# EAGLE design Mithun_CEM (EAGLE 8.3.1)
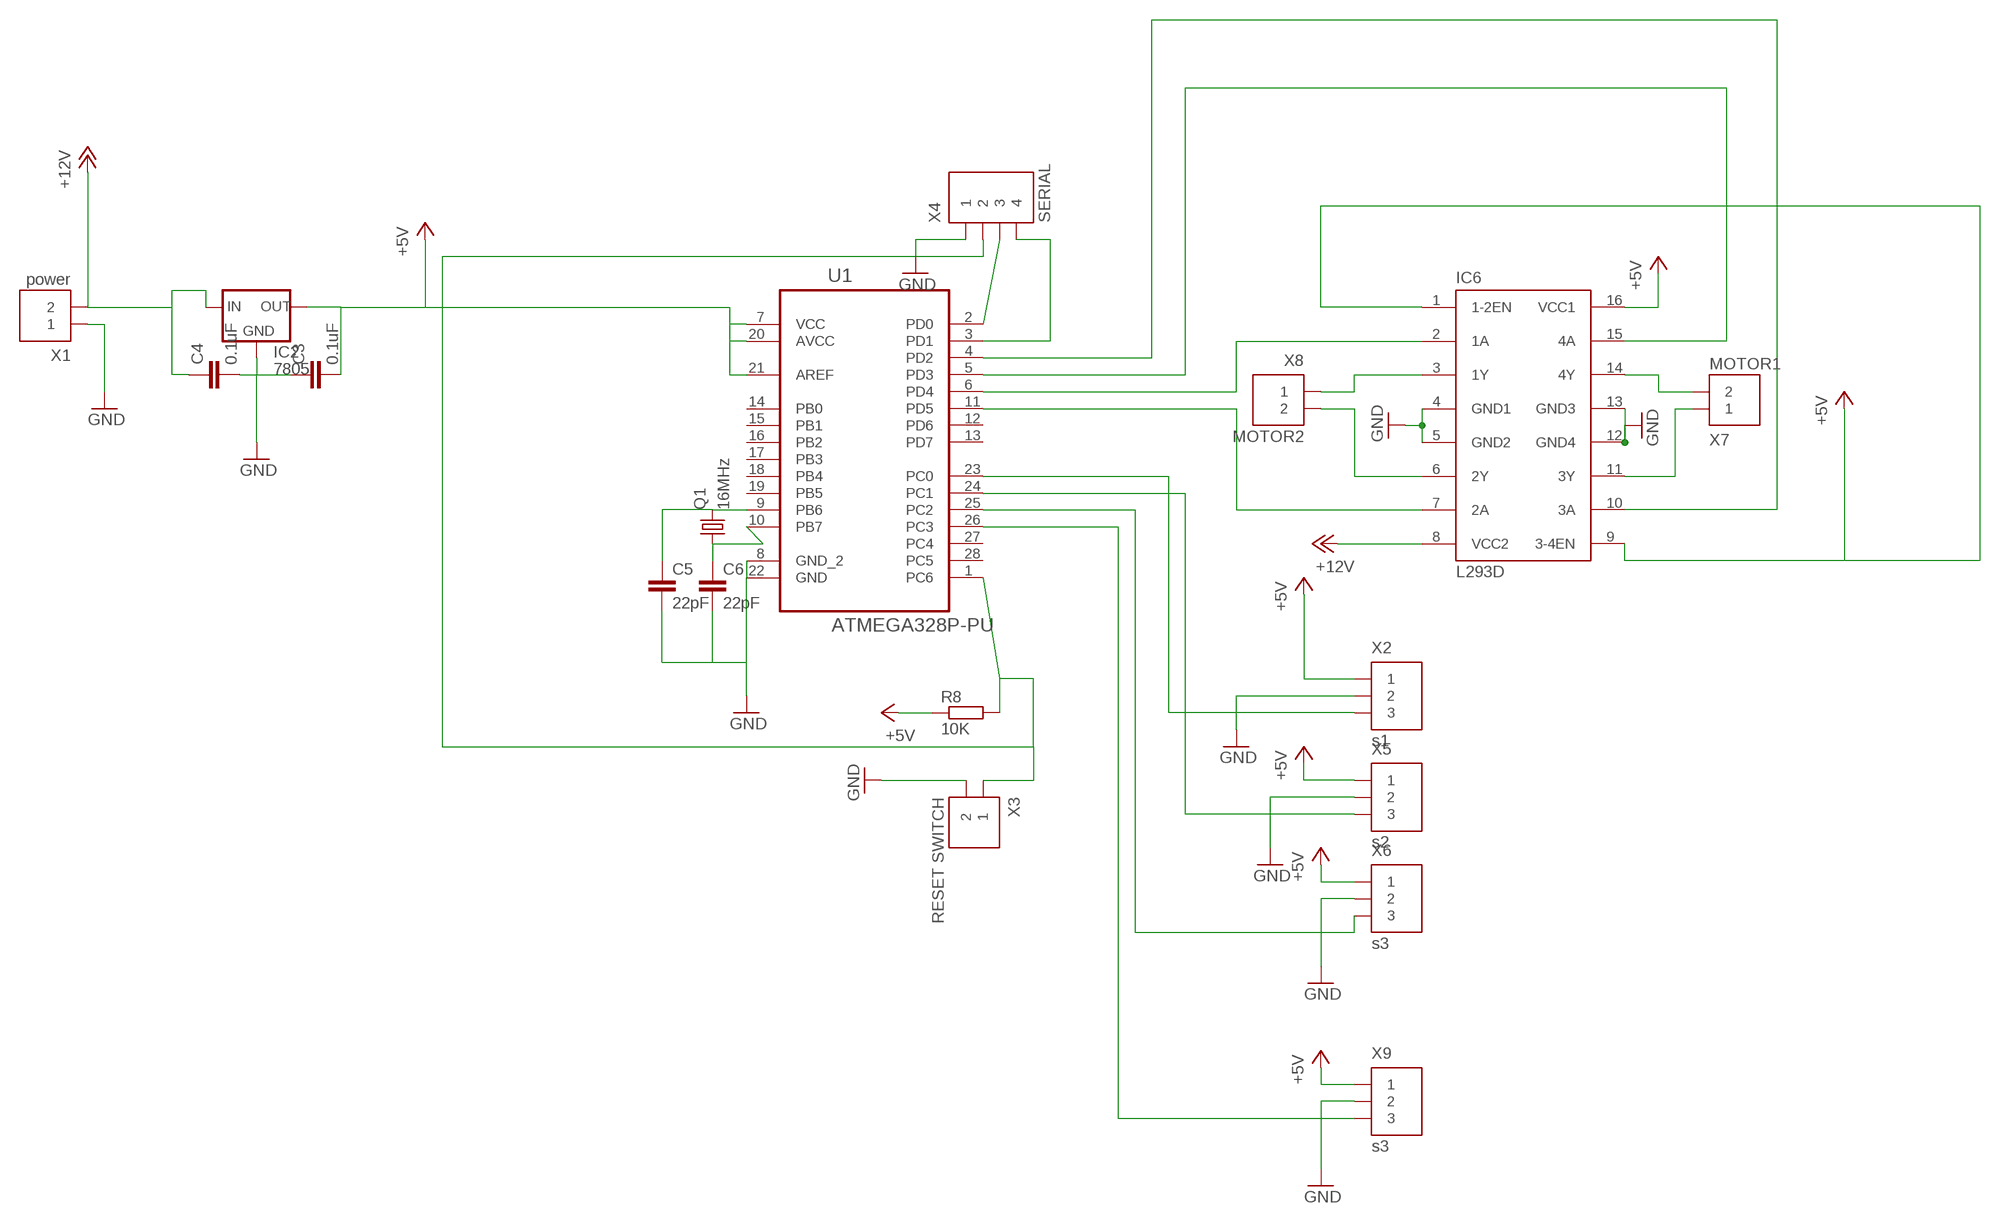
[diagram p0: schematic, sheet 1]

## Parts
C3  0.1uF  C-EU050-024X044  [C050-024X044]
C4  0.1uF  C-EU050-024X044  [C050-024X044]
C5  22pF  C-EU050-024X044  [C050-024X044]
C6  22pF  C-EU050-024X044  [C050-024X044]
IC2  7805  78MXXS  [78MXXS]
IC6  L293D  [DIL16]
Q1  16MHz  CRYSTALHC18U-V  [HC18U-V]
R8  10K  R-EU_0204/5  [0204/5]
U1  ATMEGA328P-PU  [DIP254P762X457-28]
X1  power  MKS1852-6-0-202  [MKS1852-6-0-202]
X2  s1  MKS1853-6-0-303  [MKS1853-6-0-303]
X3  RESET SWITCH  MKS1852-6-0-202  [MKS1852-6-0-202]
X4  SERIAL  MKS1854-6-0-404  [MKS1854-6-0-404]
X5  s2  MKS1853-6-0-303  [MKS1853-6-0-303]
X6  s3  MKS1853-6-0-303  [MKS1853-6-0-303]
X7  MOTOR1  MKS1852-6-0-202  [MKS1852-6-0-202]
X8  MOTOR2  MKS1852-6-0-202  [MKS1852-6-0-202]
X9  s3  MKS1853-6-0-303  [MKS1853-6-0-303]

## Nets
+5V: C3.2 IC2.OUT IC6.1(1-2EN) IC6.9(3-4EN) IC6.16(VCC1) R8.1 U1.7(VCC) U1.20(AVCC) U1.21(AREF) X2.1 X5.1 X6.1 X9.1
+12V: C4.1 IC2.IN IC6.8(VCC2) X1.2
GND: C3.1 C4.2 C5.2 C6.2 IC2.GND IC6.4(GND1) IC6.5(GND2) IC6.12(GND4) IC6.13(GND3) U1.8(GND_2) U1.22(GND) X1.1 X2.2 X3.2 X4.1 X5.2 X6.2 X9.2
N$1: IC6.15(4A) U1.5(PD3)
N$2: U1.23(PC0) X2.3
N$3: U1.26(PC3) X9.3
N$4: U1.24(PC1) X5.3
N$5: U1.25(PC2) X6.3
N$14: C5.1 Q1.2 U1.9(PB6)
N$15: C6.1 Q1.1 U1.10(PB7)
N$16: IC6.2(1A) U1.6(PD4)
N$23: R8.2 U1.1(PC6) X3.1 X4.2
N$24: U1.2(PD0) X4.3
N$30: U1.3(PD1) X4.4
N$49: IC6.10(3A) U1.4(PD2)
N$50: IC6.3(1Y) X8.1
N$51: IC6.6(2Y) X8.2
N$52: IC6.11(3Y) X7.1
N$53: IC6.14(4Y) X7.2
N$69: IC6.7(2A) U1.11(PD5)
Unconnected: U1.12(PD6) U1.13(PD7) U1.14(PB0) U1.15(PB1) U1.16(PB2) U1.17(PB3) U1.18(PB4) U1.19(PB5) U1.27(PC4) U1.28(PC5)

## Library data of the parts
C3-C6 = rcl:C-EU: CAPACITOR, European symbol
IC2 = v-reg:78MXXS: VOLTAGE REGULATOR
IC6 = st-microelectronics:L293D: PUSH-PULL 4 CHANNEL DRIVER; MPN: L293D; OC_FARNELL: 9589619; OC_NEWARK: 56P8249
Q1 = crystal:CRYSTAL: CRYSTAL; OC_FARNELL: unknown; OC_NEWARK: unknown
R8 = resistor:R-EU_: RESISTOR, European symbol
U1 = Atmel_By_element14_Batch_1-00:ATMEGA328P-PU: 8-bit Microcontroller with In-System Programmable Flash; MPN: ATMEGA328P-PU; OC_FARNELL: 1715487; OC_NEWARK: 15R0268; PACKAGE: PDIP-28; SUPPLIER: Atmel
X1 X3 X7 X8 = con-stocko:MKS1852-6-0-202: Serie MKS 1850 Lötstifte In-line, Raster 2.5 mm, Stiftwannen, stehend, mit Rastlasche Source: http://www.stocko.de/de/index.php?seite=ka_rfk2_mks1850.html&rubrik=Katalog+-+RFK+2 rfk_1850.pdf; OC_FARNELL: unknown; OC_NEWARK: unknown
X2 X5 X6 X9 = con-stocko:MKS1853-6-0-303: Serie MKS 1850 Lötstifte In-line, Raster 2.5 mm, Stiftwannen, stehend, mit Rastlasche Source: http://www.stocko.de/de/index.php?seite=ka_rfk2_mks1850.html&rubrik=Katalog+-+RFK+2 rfk_1850.pdf; OC_FARNELL: 1141861; OC_NEWARK: unknown
X4 = con-stocko:MKS1854-6-0-404: Serie MKS 1850 Lötstifte In-line, Raster 2.5 mm, Stiftwannen, stehend, mit Rastlasche Source: http://www.stocko.de/de/index.php?seite=ka_rfk2_mks1850.html&rubrik=Katalog+-+RFK+2 rfk_1850.pdf; OC_FARNELL: 1141862; OC_NEWARK: unknown

## Board
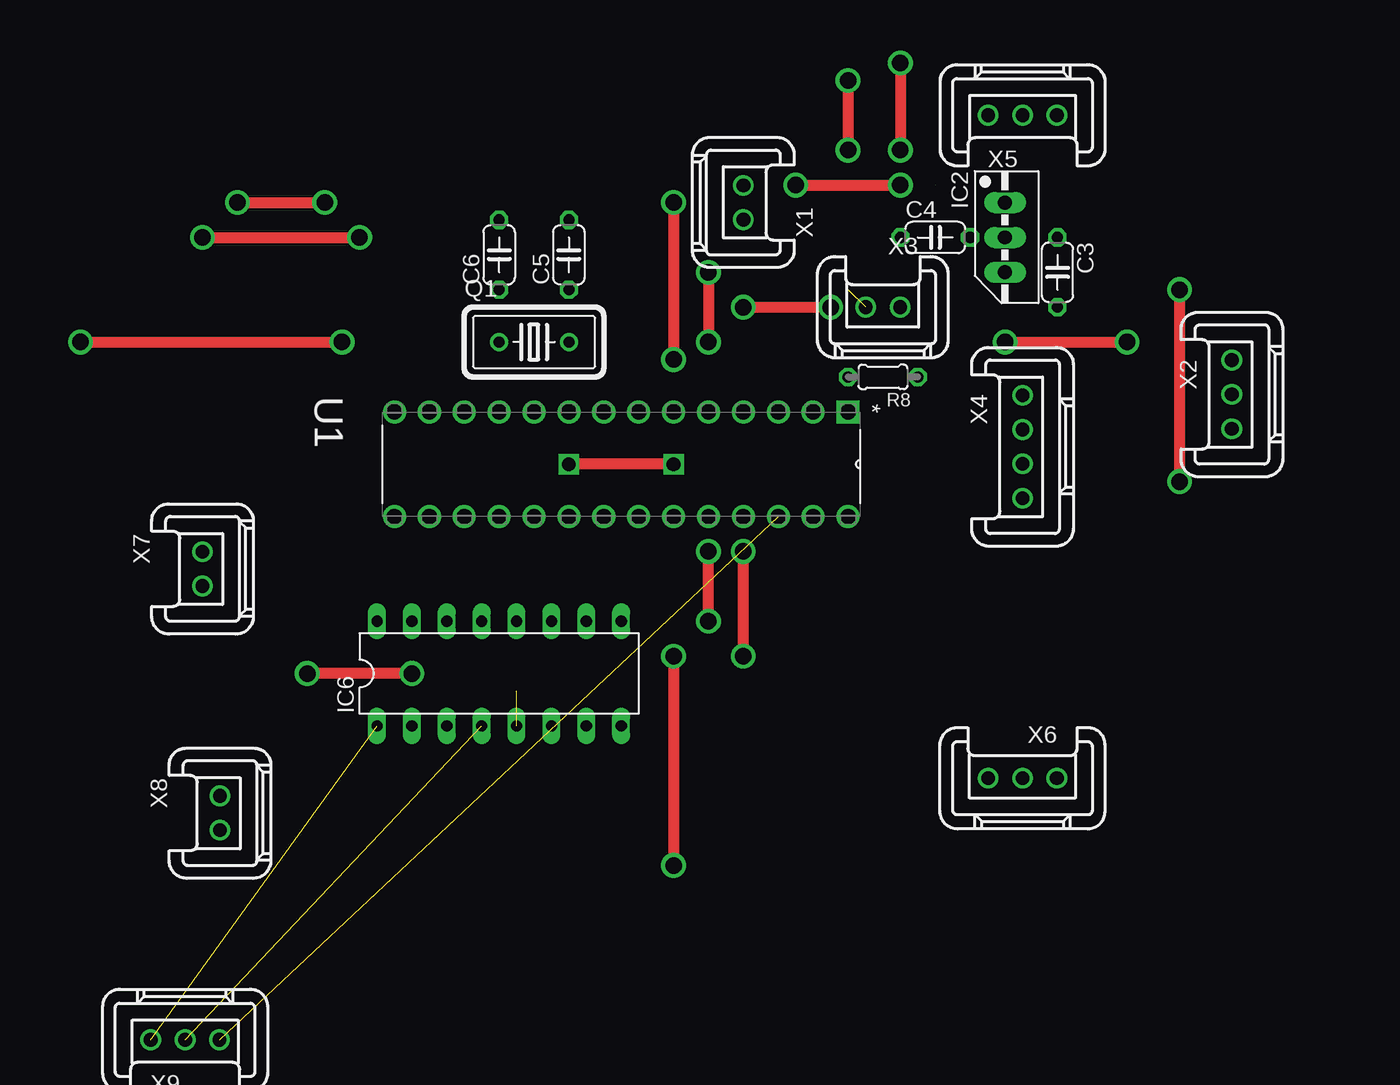
[diagram p1: board, top side]
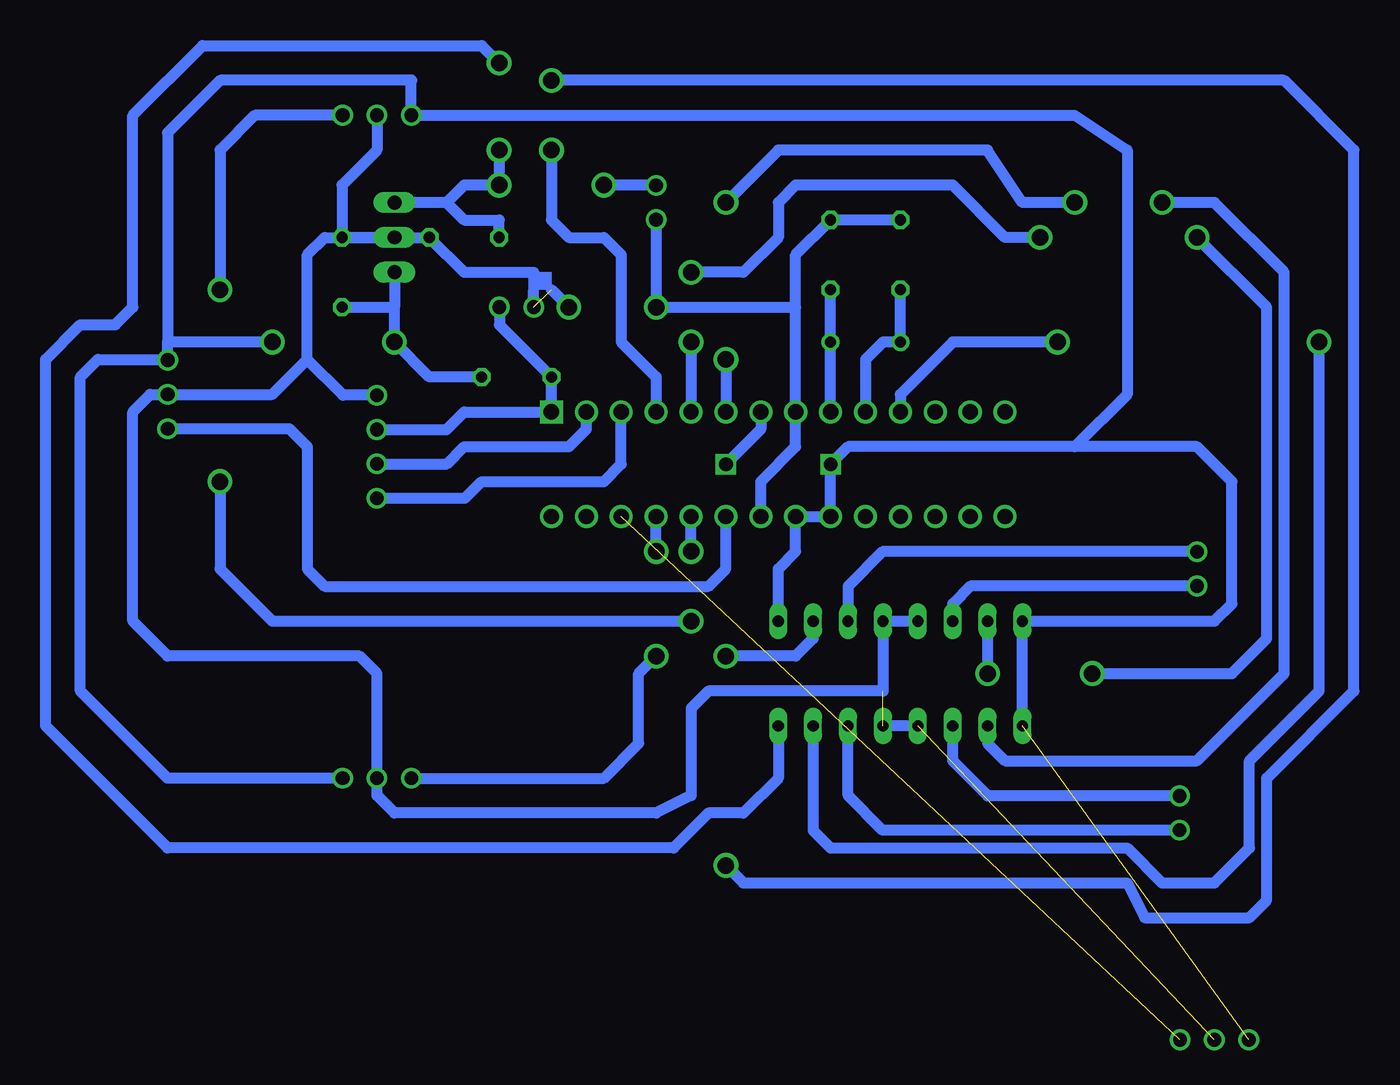
[diagram p2: board, bottom side, seen from below]

No outline drawn. Coordinates in mm, seen from the top.
Copper layers (1*16): Top 0.035mm / dielectric 1.5mm / Bottom 0.035mm
Design rules "default": minimum track width 10mil, minimum drill 24mil, track to track 8mil, track to pad 8mil, pad to pad 8mil, via to via 8mil, smd to smd 8mil, copper to edge 40mil, drill to drill 8mil, minimum pad ring 10mil, minimum via ring 8mil, stop-mask expansion 4mil, vias tented up to drill 0mil, thermal gap 10mil

### Footprints (pad centres in the part's own frame; a part is rotated, then mirrored left to right if it is on the bottom)
C050-024X044 = drill 0.813 octagon: 1 -2.54,0; 2 2.54,0
78MXXS = drill 1.016 long: GND 0,-2.54; IN -2.54,-2.54; OUT 2.54,-2.54
DIL16 = drill 0.813 long: 1 -8.89,-3.81; 2 -6.35,-3.81; 3 -3.81,-3.81; 4 -1.27,-3.81; 5 1.27,-3.81; 6 3.81,-3.81; 7 6.35,-3.81; 8 8.89,-3.81; 9 8.89,3.81; 10 6.35,3.81; 11 3.81,3.81; 12 1.27,3.81; 13 -1.27,3.81; 14 -3.81,3.81; 15 -6.35,3.81; 16 -8.89,3.81
HC18U-V = drill 0.813: 1 -2.54,0; 2 2.54,0
0204/5 = drill 0.813 octagon: 1 -2.54,0; 2 2.54,0
DIP254P762X457-28 = drill 1.118 square: 1 -7.62,33.02 | drill 1.118: 2 -7.62,30.48; 3 -7.62,27.94; 4 -7.62,25.4; 5 -7.62,22.86; 6 -7.62,20.32; 7 -7.62,17.78; 8 -7.62,15.24; 9 -7.62,12.7; 10 -7.62,10.16; 11 -7.62,7.62; 12 -7.62,5.08; 13 -7.62,2.54; 14 -7.62,0; 15 0,0; 16 0,2.54; 17 0,5.08; 18 0,7.62; 19 0,10.16; 20 0,12.7; 21 0,15.24; 22 0,17.78; 23 0,20.32; 24 0,22.86; 25 0,25.4; 26 0,27.94; 27 0,30.48; 28 0,33.02
MKS1852-6-0-202 = drill 1 pad 1.422: 1 -1.25,0; 2 1.25,0
MKS1853-6-0-303 = drill 1 pad 1.422: 1 -2.5,0; 2 0,0; 3 2.5,0
MKS1854-6-0-404 = drill 1 pad 1.422: 1 -3.75,0; 2 -1.25,0; 3 1.25,0; 4 3.75,0

### Placement (x,y rotation side)
C3  64.77,53.34 270 top
C4  55.88,55.88 0 top
C5  29.21,54.61 90 top
C6  24.13,54.61 90 top
IC2  63.5,55.88 270 top
IC6  24.13,24.13 0 top
Q1  26.67,48.26 0 top
R8  52.07,45.72 180 top
U1  16.51,35.56 270 top
X1  41.91,58.42 90 top
X2  77.47,44.45 270 top
X3  52.07,50.8 180 top
X4  62.23,40.64 270 top
X5  62.23,64.77 0 top
X6  62.23,16.51 180 top
X7  2.54,31.75 270 top
X8  3.81,13.97 270 top
X9  1.27,-2.54 0 top

### Tracks (layer width: path | path; a pad name or v marks a point on that pad's centre or on a via)
+5V  (via drill 1 pad 1.27, 1.2 pad 1.02)  (1 unrouted)
  Top 0.813: v36.83,39.37 v29.21,39.37 | v60.96,48.26 v69.85,48.26
  Bottom 0.813: U1.7 34.29,41.91 v36.83,39.37 | 77.47,46.99 X2.1 | 11.43,40.64 7.62,44.45 7.62,62.23 11.43,64.77 X5.1 59.73,67.27 | 11.43,40.64 27.94,40.64 v29.21,39.37 U1.20 U1.21 31.75,33.02 33.02,31.75 IC6.9 | X6.1 77.47,16.51 83.82,22.86 83.82,45.72 82.55,46.99 77.47,46.99 | R8.1 58.42,45.72 v60.96,48.26 60.96,50.8 | C3.2 60.96,50.8 | IC2.OUT 60.96,50.8 | v69.85,48.26 77.47,48.26 | 59.73,67.27 59.73,67.35 59.69,67.31 | 59.73,67.27 59.69,67.31 | 59.69,67.31 73.66,67.31 77.47,63.5 77.47,48.26 | 77.47,46.99 77.47,48.26 | IC6.1 IC6.16 1.27,27.94 0,29.21 0,38.1 2.54,40.64 11.43,40.64
+12V  (via drill 1.2 pad 1.02)  (1 unrouted)
  Top 0.813: v45.72,59.69 v53.34,59.69 | v53.34,68.58 v53.34,62.23
  Bottom 0.813: C4.1 53.34,57.15 55.88,57.15 57.15,58.42 | 55.9,59.67 57.15,58.42 | 57.15,58.42 IC2.IN | X1.2 45.7,59.67 v45.72,59.69 | 55.88,59.69 v53.34,59.69 v53.34,62.23 | IC6.8 33.02,16.51 35.56,13.97 38.1,13.97 40.64,11.43 77.47,11.43 86.36,20.32 86.36,46.99 83.82,49.53 81.28,49.53 80.01,50.8 80.01,64.77 74.93,69.85 54.61,69.85 v53.34,68.58
GND  (via drill 1.2 pad 1.02)  (3 unrouted)
  Top 0.813: v41.91,50.8 v48.26,50.8
  Bottom 0.813: U1.22 34.29,38.1 31.75,40.64 U1.8 31.75,50.8 | C3.1 IC2.GND C4.2 | X3.2 50.8,53.34 55.88,53.34 C4.2 | X4.1 64.71,44.39 67.31,46.99 | 67.31,46.99 67.31,54.61 66.04,55.88 C3.1 | C3.1 C4.2 | C6.2 C5.2 31.75,54.61 31.75,50.8 | 31.75,50.8 v41.91,50.8 X1.1 | X5.2 62.23,62.23 64.77,59.69 C3.1 | 67.31,46.99 69.85,44.45 X2.2 78.74,44.45 80.01,43.18 80.01,27.94 77.47,25.4 63.5,25.4 62.23,24.13 X6.2 62.23,15.24 60.96,13.97 41.91,13.97 39.37,15.24 39.37,21.59 38.1,22.86 25.4,22.86 IC6.12 IC6.13 | 49.53,52.07 v48.26,50.8 | IC6.4 IC6.5
N$1  (via drill 1.2 pad 1.02)
  Top 0.813: v17.78,24.13 v10.16,24.13 | v2.54,55.88 v13.97,55.88 | v39.37,53.34 v39.37,48.26
  Bottom 0.813: IC6.15 v17.78,24.13 | v10.16,24.13 0,24.13 -2.54,26.67 -2.54,50.8 v2.54,55.88 | v13.97,55.88 16.51,55.88 20.32,59.69 31.75,59.69 33.02,58.42 33.02,55.88 35.56,53.34 v39.37,53.34 | v39.37,48.26 U1.5
N$2
  Bottom 0.813: X2.3 68.62,41.95 67.31,40.64 67.31,31.75 66.04,30.48 38.1,30.48 36.83,31.75 U1.23
N$3  (1 unrouted)
N$4  (via drill 1.2 pad 1.02)
  Top 0.813: v73.66,52.07 v73.66,38.1 | v39.37,27.94 v39.37,33.02
  Bottom 0.813: X5.3 71.12,64.77 73.66,62.23 v73.66,52.07 | v73.66,38.1 73.66,31.75 69.85,27.94 v39.37,27.94 | v39.37,33.02 U1.24
N$5  (via drill 1.2 pad 1.02)
  Top 0.813: v41.91,25.4 v41.91,33.02
  Bottom 0.813: X6.3 45.72,16.51 43.18,19.05 43.18,24.13 v41.91,25.4 | v41.91,33.02 U1.25
N$14
  Bottom 0.813: U1.9 Q1.2 C5.1
N$15
  Bottom 0.813: U1.10 26.67,46.99 25.4,48.26 Q1.1 C6.1
N$16  (via drill 1.2 pad 1.02)
  Top 0.813: v5.08,58.42 v11.43,58.42 | v36.83,58.42 v36.83,46.99
  Bottom 0.813: IC6.2 17.78,19.05 16.51,17.78 2.54,17.78 -3.81,24.13 -3.81,53.34 1.27,58.42 v5.08,58.42 | v11.43,58.42 15.24,58.42 17.78,62.23 33.02,62.23 v36.83,58.42 | v36.83,46.99 U1.6
N$23
  Bottom 0.813: X3.1 53.32,49.51 R8.2 U1.1 55.88,43.18 57.17,41.89 X4.2
N$24
  Bottom 0.813: X4.3 57.13,39.39 55.88,40.64 48.26,40.64 46.99,41.91 U1.2
N$30
  Bottom 0.813: X4.4 55.82,36.89 54.61,38.1 45.72,38.1 44.45,39.37 U1.3
N$49  (via drill 1.2 pad 1.02)
  Top 0.813: v36.83,25.4 v36.83,10.16 | v49.53,67.31 v49.53,62.23
  Bottom 0.813: IC6.10 30.48,26.67 31.75,25.4 v36.83,25.4 | v36.83,10.16 35.56,8.89 7.62,8.89 6.35,6.35 -1.27,6.35 -2.54,7.62 -2.54,16.51 -8.89,22.86 -8.89,62.23 -3.81,67.31 v49.53,67.31 | v49.53,62.23 49.53,57.15 48.26,55.88 45.72,55.88 44.45,54.61 44.45,48.26 41.91,45.72 U1.4
N$50
  Bottom 0.813: X8.1 17.76,15.22 20.32,17.78 IC6.3
N$51
  Bottom 0.813: X8.2 25.42,12.72 27.94,15.24 IC6.6
N$52
  Bottom 0.813: X7.1 25.42,33 27.94,30.48 IC6.11
N$53
  Bottom 0.813: X7.2 19.03,30.5 20.32,29.21 IC6.14
N$69  (via drill 1.2 pad 1.02)
  Top 0.813: v-6.35,48.26 v12.7,48.26
  Bottom 0.813: IC6.7 30.48,12.7 29.21,11.43 7.62,11.43 5.08,8.89 1.27,8.89 -1.27,11.43 -1.27,17.78 -6.35,22.86 v-6.35,48.26 | v12.7,48.26 20.32,48.26 24.13,44.45 U1.11
(copper drawn outside any net)
  shapes: Bottom area x1